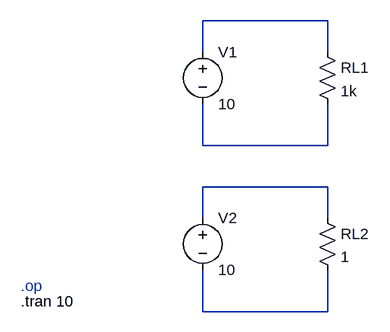
[diagram p0: schematic circuit.asc]
circuit.asc, the LTspice schematic file:
Version 4.1
SHEET 1 880 680
WIRE 160 64 -32 64
WIRE -32 112 -32 64
WIRE 160 112 160 64
WIRE -32 256 -32 192
WIRE 160 256 160 192
WIRE 160 256 -32 256
WIRE 160 320 -32 320
WIRE -32 368 -32 320
WIRE 160 368 160 320
WIRE -32 512 -32 448
WIRE 160 512 160 448
WIRE 160 512 -32 512
DATAFLAG 160 64 ""
DATAFLAG 160 320 ""
DATAFLAG -16 64 "round(-I(V1)*1k)/1k"
DATAFLAG -16 320 "-I(V2)"
SYMBOL voltage -32 96 R0
WINDOW 123 0 0 Left 0
WINDOW 39 0 0 Left 0
SYMATTR InstName V1
SYMATTR Value 10
SYMBOL res 144 96 R0
SYMATTR InstName RL1
SYMATTR Value 1k
SYMBOL voltage -32 352 R0
WINDOW 123 0 0 Left 0
WINDOW 39 0 0 Left 0
SYMATTR InstName V2
SYMATTR Value 10
SYMBOL res 144 352 R0
SYMATTR InstName RL2
SYMATTR Value 1
TEXT -312 472 Left 2 ;.op
TEXT -312 496 Left 2 !.tran 10

The netlist it stands for:
* circuit.asc
V1 N001 N002 10
RL1 N001 N002 1k
V2 N003 N004 10
RL2 N003 N004 1
* .op
.tran 10
.backanno
.end